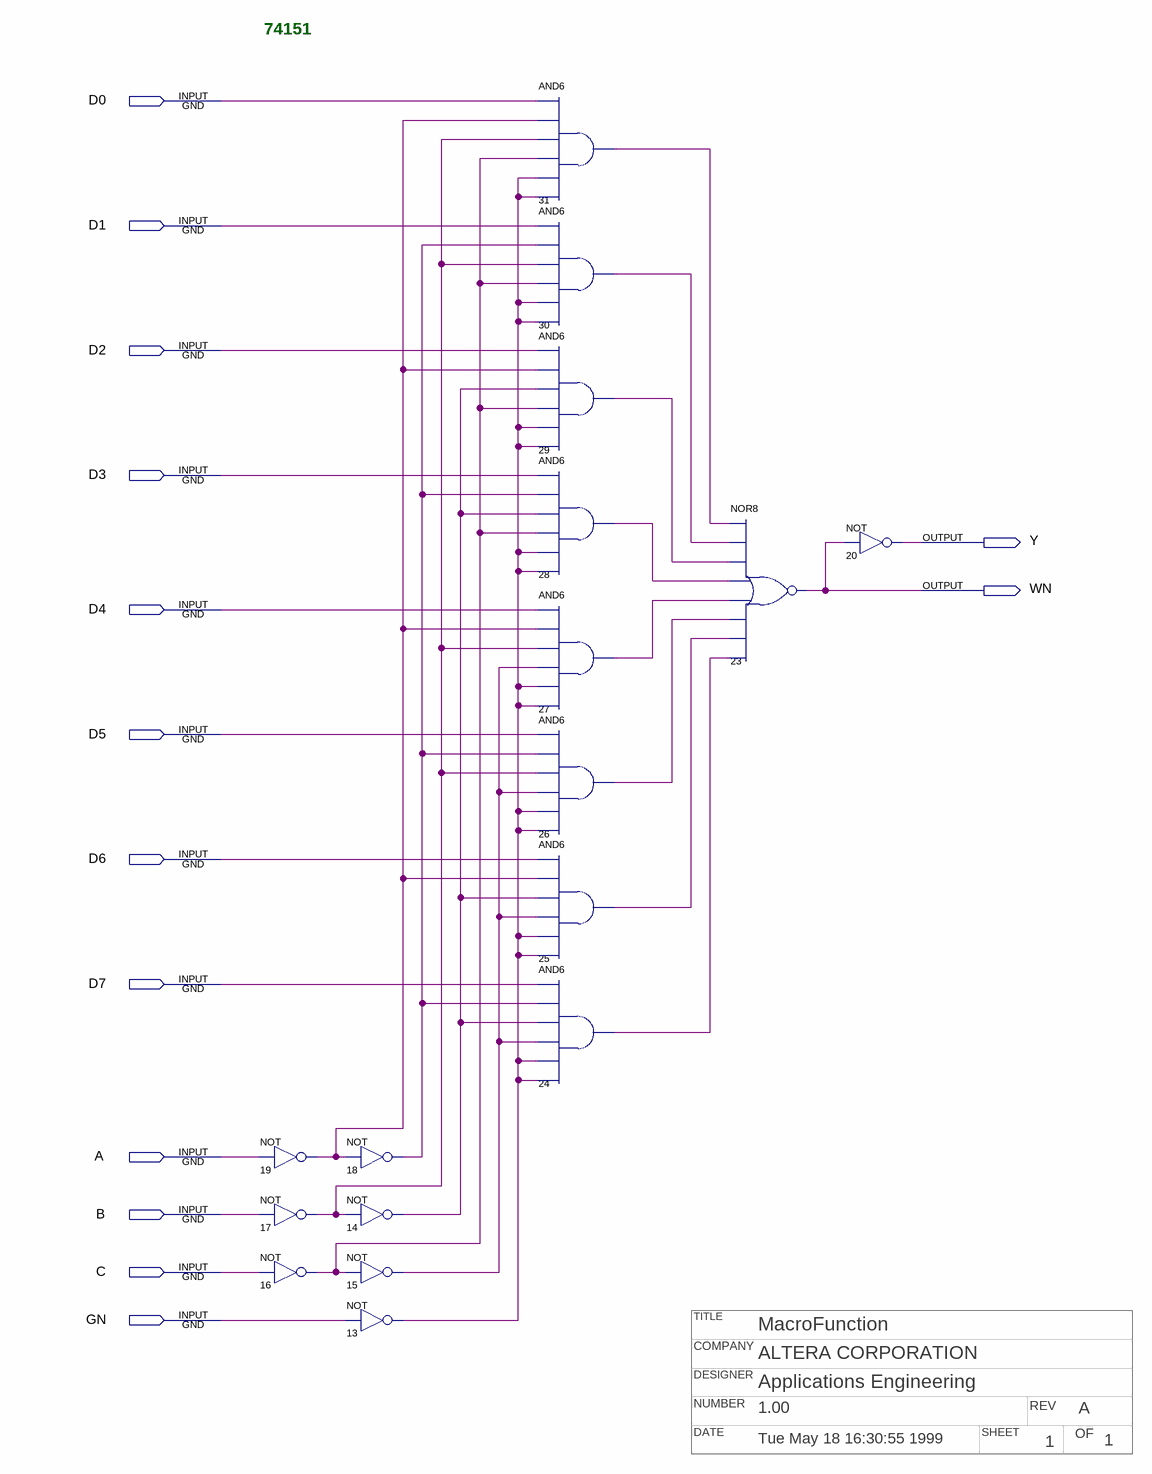
[diagram p0: schematic sheet]
// Quartus schematic p74151.bdf as structural Verilog: 17 symbols, 14 pins
// Title block: TITLE: MacroFunction; COMPANY: ALTERA CORPORATION; DESIGNER: Applications Engineering; NUMBER: 1.00; REV: A; DATE: Tue May 18 16:30:55 1999; SHEET: 1; OF: 1
module p74151 (
  input  D0,
  input  D1,
  input  D2,
  input  D3,
  input  D4,
  input  D5,
  input  D6,
  input  D7,
  input  A,
  input  B,
  input  C,
  input  GN,
  output Y,
  output WN
);

  wire n13_out, n14_out, n15_out, n16_out, n17_out, n18_out, n19_out, n24_out, n25_out, n26_out, n27_out,
       n28_out, n29_out, n30_out, n31_out;

  not u_19 (n19_out, A);
  not u_17 (n17_out, B);
  not u_16 (n16_out, C);
  not u_18 (n18_out, n19_out);
  not u_14 (n14_out, n17_out);
  not u_15 (n15_out, n16_out);
  not u_13 (n13_out, GN);
  and u_31 (n31_out, D0, n19_out, n17_out, n16_out, n13_out, n13_out);
  and u_30 (n30_out, D1, n18_out, n17_out, n16_out, n13_out, n13_out);
  and u_29 (n29_out, D2, n19_out, n14_out, n16_out, n13_out, n13_out);
  and u_28 (n28_out, D3, n18_out, n14_out, n16_out, n13_out, n13_out);
  and u_27 (n27_out, D4, n19_out, n17_out, n15_out, n13_out, n13_out);
  and u_26 (n26_out, D5, n18_out, n17_out, n15_out, n13_out, n13_out);
  and u_25 (n25_out, D6, n19_out, n14_out, n15_out, n13_out, n13_out);
  and u_24 (n24_out, D7, n18_out, n14_out, n15_out, n13_out, n13_out);
  nor u_23 (WN, n31_out, n30_out, n29_out, n28_out, n27_out, n26_out, n25_out, n24_out);
  not u_20 (Y, WN);

  // Notes on the sheet:
  //   74151
endmodule
